# EAGLE design xbeeRFsocket-v00 (EAGLE 5.11)
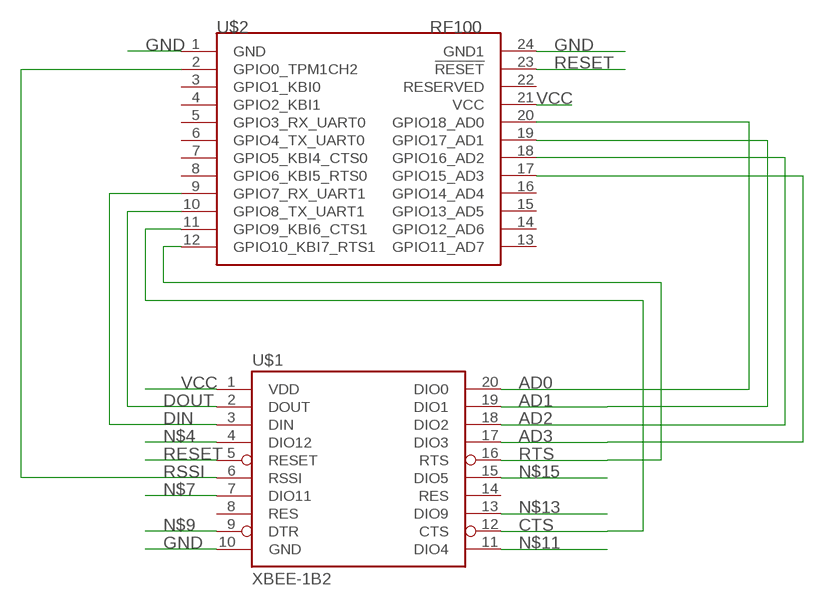
[diagram p0: schematic, sheet 1]

## Parts
U$1  XBEE-1B2  [XBEE-SILK]
U$2  SYNAPSEWIRELESS-RFENGINESTDTHM  [SYNAPSERFENGINE-THM]

## Nets
AD0: U$1.20(DIO0) U$2.20(GPIO18_AD0)
AD1: U$1.19(DIO1) U$2.19(GPIO17_AD1)
AD2: U$1.18(DIO2) U$2.18(GPIO16_AD2)
AD3: U$1.17(DIO3) U$2.17(GPIO15_AD3)
CTS: U$1.12(CTS) U$2.11(GPIO9_KBI6_CTS1)
DIN: U$1.3(DIN) U$2.9(GPIO7_RX_UART1)
DOUT: U$1.2(DOUT) U$2.10(GPIO8_TX_UART1)
GND: U$1.10(GND) U$2.1(GND) U$2.24(GND1)
N$4: U$1.4(DIO12)
N$7: U$1.7(DIO11)
N$9: U$1.9(DTR)
N$11: U$1.11(DIO4)
N$13: U$1.13(DIO9)
N$15: U$1.15(DIO5)
RESET: U$1.5(RESET) U$2.23(!RESET)
RSSI: U$1.6(RSSI) U$2.2(GPIO0_TPM1CH2)
RTS: U$1.16(RTS) U$2.12(GPIO10_KBI7_RTS1)
VCC: U$1.1(VDD) U$2.21(VCC)
Unconnected: U$1.8(RES) U$1.14(RES) U$2.3(GPIO1_KBI0) U$2.4(GPIO2_KBI1) U$2.5(GPIO3_RX_UART0) U$2.6(GPIO4_TX_UART0) U$2.7(GPIO5_KBI4_CTS0) U$2.8(GPIO6_KBI5_RTS0) U$2.13(GPIO11_AD7) U$2.14(GPIO12_AD6) U$2.15(GPIO13_AD5) U$2.16(GPIO14_AD4) U$2.22(RESERVED)

## Library data of the parts
U$1 = SparkFun:XBEE-1
U$2 = 0_jc-custom:SYNAPSEWIRELESS-RFENGINE

## Net classes
0 default: width 0.305 mm

## Board
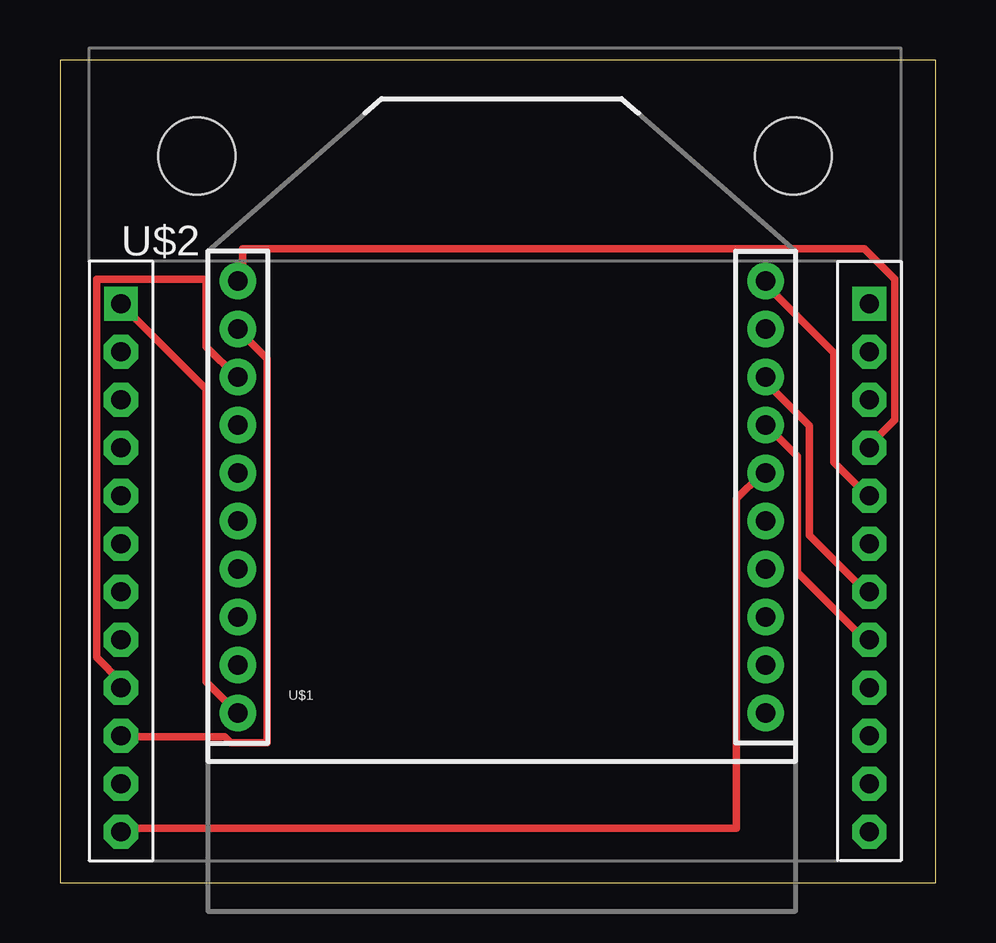
[diagram p1: board, top side]
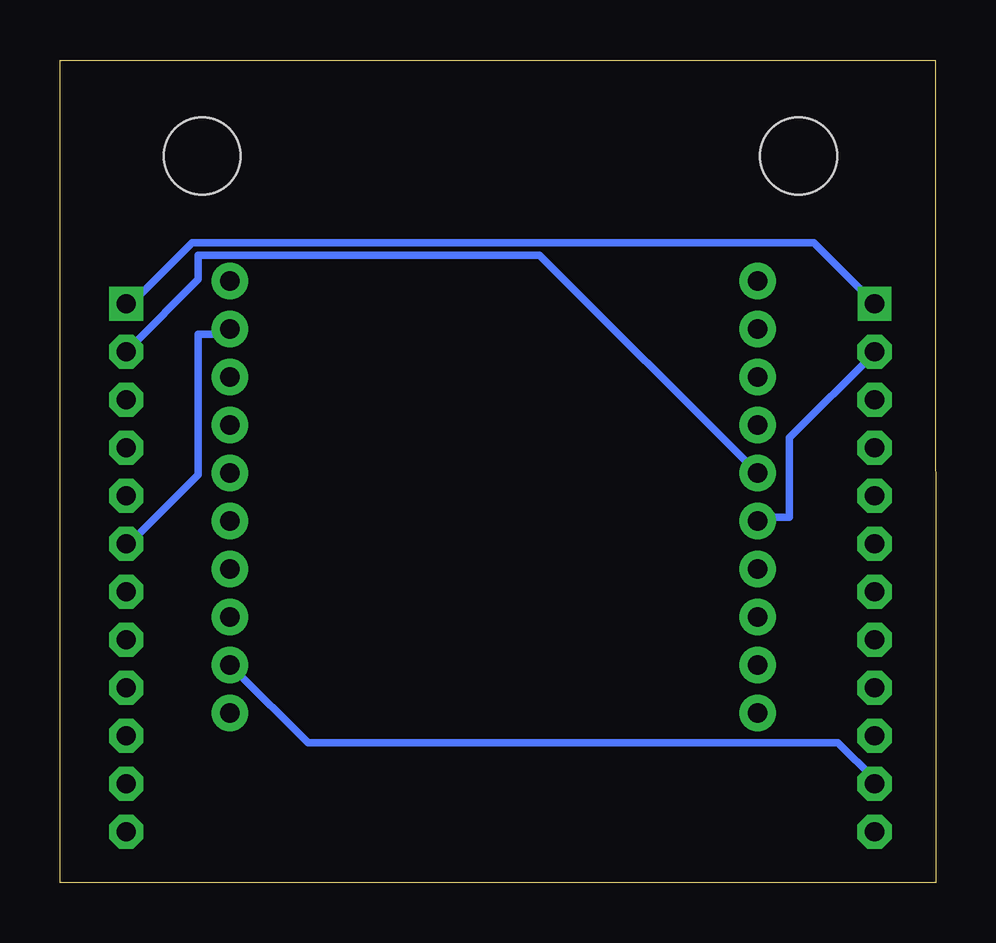
[diagram p2: board, bottom side, seen from below]

Size 36.5 x 34.29 mm. Coordinates in mm from the lower left corner, seen from the top.
Outline: 0,0 36.5,0 36.5,34.28 0.01,34.29 0,0
Copper layers (1*16): Top 0.0356mm / dielectric 1.5011mm / Bottom 0.0356mm
Design rules "LaenPCBOrder-JCModified": minimum track width 6mil, minimum drill 13mil, track to track 6mil, track to pad 6mil, pad to pad 6mil, via to via 6mil, smd to smd 6mil, copper to edge 15mil, drill to drill 6mil, minimum pad ring 12mil, minimum via ring 7mil, stop-mask expansion 4mil, vias tented up to drill 25mil, thermal gap 10mil

### Footprints (pad centres in the part's own frame; a part is rotated, then mirrored left to right if it is on the bottom)
XBEE-SILK = drill 0.8 pad 1.524 round: 1 -11,20; 2 -11,18; 3 -11,16; 4 -11,14; 5 -11,12; 6 -11,10; 7 -11,8; 8 -11,6; 9 -11,4; 10 -11,2; 11 11,2; 12 11,4; 13 11,6; 14 11,8; 15 11,10; 16 11,12; 17 11,14; 18 11,16; 19 11,18; 20 11,20
SYNAPSERFENGINE-THM = drill 0.8 square: 1 0,0; 24 31.2,0 | drill 0.8 pad 1.422 octagon: 2 0,-2; 3 0,-4; 4 0,-6; 5 0,-8; 6 0,-10; 7 0,-12; 8 0,-14; 9 0,-16; 10 0,-18; 11 0,-20; 12 0,-22; 13 31.2,-22; 14 31.2,-20; 15 31.2,-18; 16 31.2,-16; 17 31.2,-14; 18 31.2,-12; 19 31.2,-10; 20 31.2,-8; 21 31.2,-6; 22 31.2,-4; 23 31.2,-2 | hole 3.2: 3.17,6.16; 28.03,6.16

### Placement (x,y rotation side)
U$1  18.42,5.08 0 top
U$2  2.54,24.13 0 top

### Tracks (layer width: path | path; a pad name or v marks a point on that pad's centre or on a via)
AD0
  Top 0.305: U$2.20 33.53,16.26 32.26,17.53 32.26,22.1 29.46,24.89 U$1.20
AD1
  Bottom 0.305: U$2.19 33.53,14.22 30.73,17.02 30.73,22.86 29.46,22.86 U$1.19
AD2
  Top 0.305: U$2.18 33.53,12.19 31.24,14.48 31.24,19.05 29.46,20.83 U$1.18
AD3
  Top 0.305: U$2.17 33.53,10.16 30.73,12.95 30.73,17.78 29.46,19.05 U$1.17
CTS
  Bottom 0.305: U$2.11 2.54,4.32 4.06,5.84 26.16,5.84 29.21,8.89 U$1.12
DIN
  Top 0.305: U$2.9 2.54,8.38 1.52,9.4 1.52,25.15 6.1,25.15 6.1,22.35 7.37,21.08 U$1.3
DOUT
  Top 0.305: U$2.10 2.54,6.1 6.86,6.1 7.11,5.84 8.64,5.84 8.64,21.84 7.62,22.86 U$1.2
GND
  Top 0.305: U$2.1 6.1,20.57 6.1,8.38 7.37,7.11 U$1.10
  Bottom 0.305: U$2.1 5.08,26.67 30.99,26.67 33.53,24.13 U$2.24
RESET
  Bottom 0.305: U$2.23 33.53,22.35 30.73,25.15 30.73,26.16 16.51,26.16 7.62,17.27 U$1.5
RSSI
  Bottom 0.305: U$2.2 2.54,22.1 6.1,18.54 6.1,15.24 7.37,15.24 U$1.6
RTS
  Top 0.305: U$2.12 2.54,2.29 28.19,2.29 28.19,16 29.21,17.02 U$1.16
VCC
  Top 0.305: U$2.21 33.78,18.29 34.8,19.3 34.8,25.15 33.53,26.42 7.62,26.42 7.62,25.15 U$1.1